# EAGLE design placa1 (EAGLE 8.2.2)
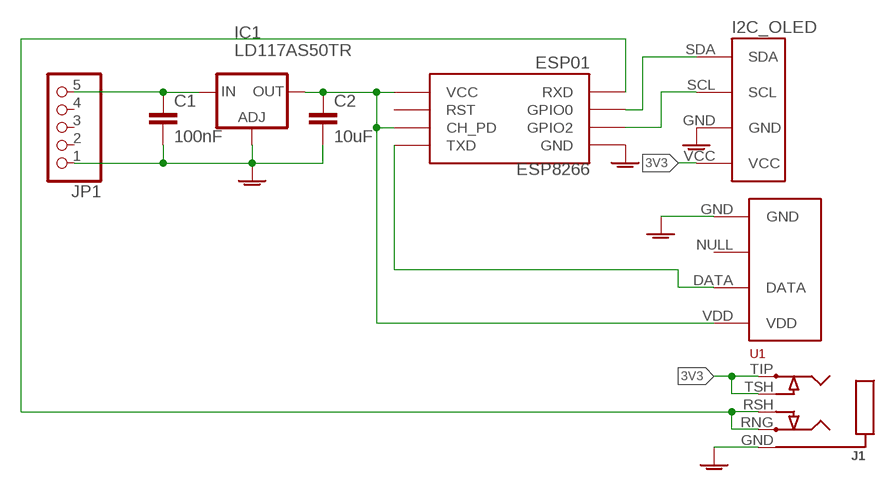
[diagram p0: schematic, sheet 1]

## Parts
C1  100nF  C-EUC1206K  [C1206K]
C2  10uF  C-EUC1206K  [C1206K]
ESP8266  ESP01  [ESP01]
IC1  LD117AS50TR  [SOT223]
J1  STEREOJACKSJ1-352XNG  [SJ1-352XNG]
JP1  PINHD-1X5  [1X05]
OLED  I2C_OLED  [I2C_OLED_PACKAGE]
U1  RHT03_DHT-22_AM2302RA  [RHT03_DHT-22/RA]

## Nets
3V3: C2.1 ESP8266.CH_PD ESP8266.VCC IC1.2(OUT) J1.TIP J1.TSH OLED.VCC U1.VDD
5V: C1.1 IC1.3(IN) JP1.5
DATA: ESP8266.TX(TXD) U1.DATA
GND: C1.2 C2.2 ESP8266.GND IC1.1(ADJ) J1.GND JP1.1 OLED.GND U1.GND ; supply symbol labelled GNDA
N$3: ESP8266.GPIO2 OLED.SCL
RX: ESP8266.RX(RXD) J1.RNG J1.RSH
SDA: ESP8266.GPIO0 OLED.SDA
Unconnected: ESP8266.RST JP1.2 JP1.3 JP1.4 U1.NULL

## Library data of the parts
C1 C2 = rcl:C-EU: CAPACITOR, European symbol
ESP8266 = esp8266modules:ESP01: ESP8266 Wifi module 01
IC1 = v-reg:LD117A?*: Low drop fixed and adjustable positive voltage regulators 1 A Source: http://www.st.com/stonline/products/literature/ds/7194/ld1117axx.pdf
J1 = Ai_Connectors:STEREOJACK: MIC/HEADPHONE JACK Stereo jack with two switches. Kycon STX3100, CUI SJ1-3555NG and/or 4UCon 05544
JP1 = pinhead:PINHD-1X5: PIN HEADER
OLED = DIYMall_OLED:I2C_OLED
U1 = dht22:RHT03_DHT-22_AM2302: RHT03 / DHT-22 / AM2302 Packages and symbol for the RHT03 / DHT-22 relative humidity and temperature sensor. Note: The AM2302 is a wired version of the DHT-22 which typically requires less clearance and is thus provided as a separate package.; PROD_ID: SEN-10167

## Board
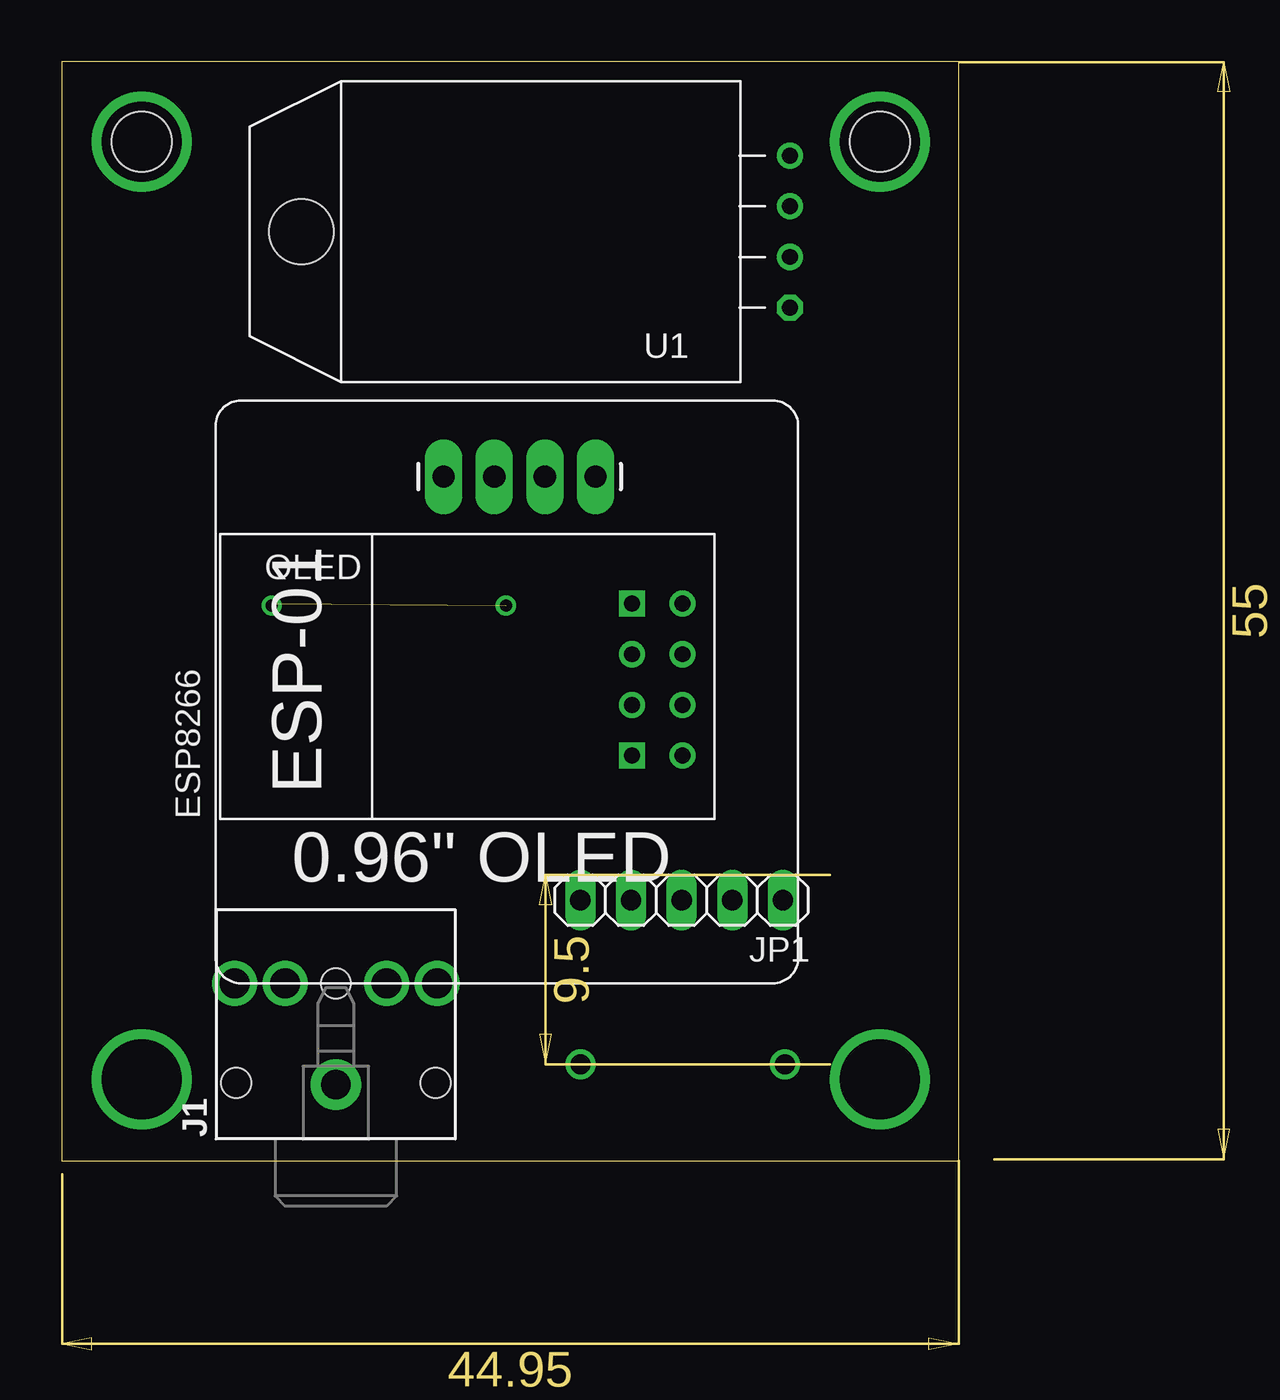
[diagram p1: board, top side]
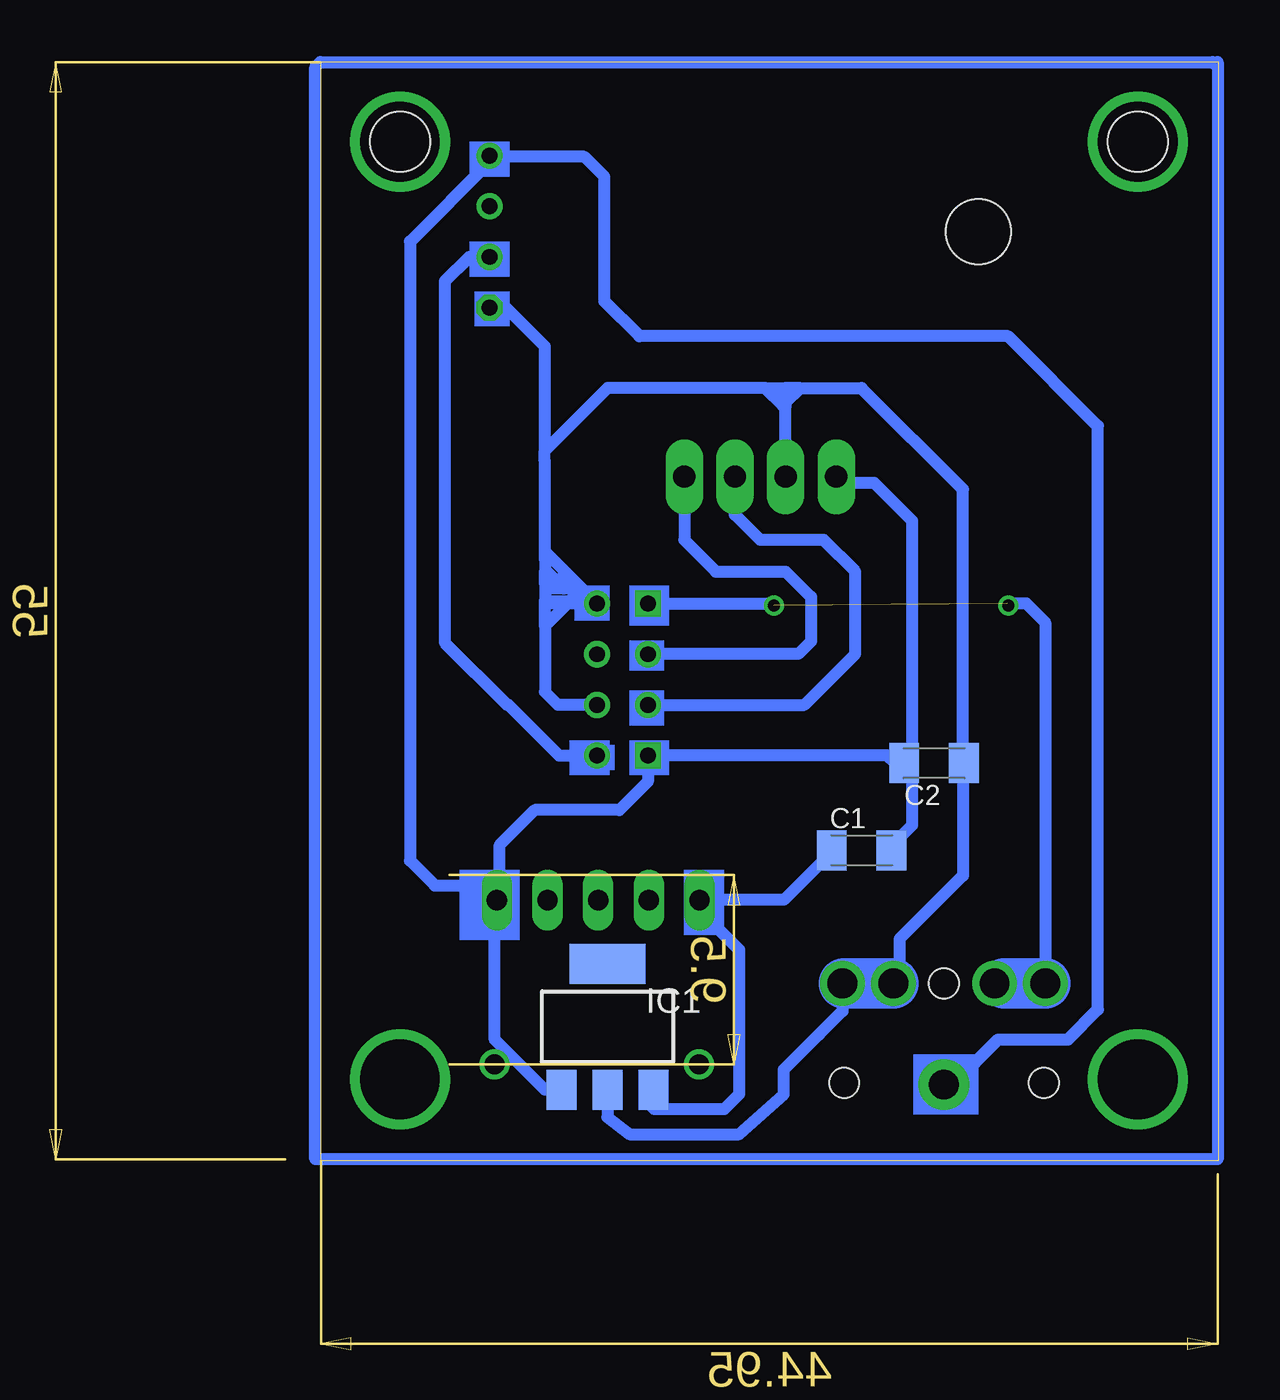
[diagram p2: board, bottom side, seen from below]

Size 44.98 x 55.12 mm. Coordinates in mm from the lower left corner, seen from the top.
Outline: 0,0 44.98,0 44.98,55.12 0,55.12 0,0
Copper layers (1*16): Top 0.035mm / dielectric 1.5mm / Bottom 0.035mm
Design rules "default": minimum track width 10mil, minimum drill 24mil, track to track 8mil, track to pad 8mil, pad to pad 8mil, via to via 8mil, smd to smd 8mil, copper to edge 40mil, drill to drill 8mil, minimum pad ring 10mil, minimum via ring 8mil, stop-mask expansion 4mil, vias tented up to drill 0mil, thermal gap 10mil
Holes 3 mm at 41.03,51.09 4.03,51.09

### Footprints (pad centres in the part's own frame; a part is rotated, then mirrored left to right if it is on the bottom)
C1206K = smd 1.5 x 2: 1 -1.5,0; 2 1.5,0
ESP01 = drill 0.8: CH_PD -1.285,-8.178; GPIO0 1.255,-5.638; GPIO2 -1.285,-5.638; RST 1.255,-8.178; TX -3.825,-8.178; VCC 3.795,-8.178 | drill 0.8 square: GND -3.825,-5.638; RX 3.795,-5.638
SOT223 = smd 1.5 x 2: 1 -2.3,-3.15; 2 0,-3.15; 3 2.3,-3.15 | smd 3.8 x 2: 4 0,3.15
SJ1-352XNG = drill 1.5 pad 2.54: GND -5.08,0 | drill 1.5: RNG 0,5.08; RSH 0,2.54; TIP 0,-5.08; TSH 0,-2.54 | hole 1.5: -5,5; -5,-5; 0,0
1X05 = drill 1.016 long: 1 -5.08,0; 2 -2.54,0; 3 0,0; 4 2.54,0; 5 5.08,0
I2C_OLED_PACKAGE = drill 1.118 pad 1.88 long: GND 0,0; SCL 5.08,0; SDA 7.62,0; VCC 2.54,0
RHT03_DHT-22/RA = drill 0.8: DATA -1.27,0; GND 3.81,0; NULL 1.27,0 | drill 0.8 octagon: VDD -3.81,0 | hole 3.25: 0,24.5

### Placement (x,y rotation side)
C1  17.88,15.58 0 bottom
C2  14.25,19.95 180 bottom
ESP8266  22.96,24.15 90 top
IC1  30.62,6.73 0 bottom
J1  13.75,8.91 90 top
JP1  31.09,13.08 180 top
OLED  19.15,34.31 0 top
U1  36.53,46.59 90 top

### Tracks (layer width: path | path; a pad name or v marks a point on that pad's centre or on a via)
3V3
  Bottom 0.61: OLED.VCC 21.69,37.84 | 21.69,38.05 21.69,38.75 | 32.81,29.61 33.76,30.56 33.76,30.17 | 32.81,29.61 31.89,28.7 | 31.89,28.7 ESP8266.VCC | 33.76,28.97 33.76,29.55 | 33.76,30.17 33.76,29.55 | 33.76,28.97 33.76,28.09 | 33.76,26.82 33.76,28.09 | 33.76,26.82 33.76,23.52 33.12,22.88 31.15,22.88 ESP8266.CH_PD | 20.98,38.75 21.69,38.75 | 20.98,38.75 17.88,38.75 12.8,33.67 12.8,19.2 | ESP8266.VCC 33.62,27.95 33.76,28.09 | 33.76,28.09 32.51,28.09 31.89,28.7 | 31.89,28.7 32.81,28.7 | 32.81,28.7 33.49,28.7 33.76,28.97 | 33.76,29.55 33.66,29.55 32.81,28.7 | 32.81,28.7 32.81,29.61 | ESP8266.VCC 32.64,27.95 33.76,26.82 | 16.58,8.91 J1.TSH 18.11,8.91 18.43,8.58 | 12.8,19.2 12.8,14.31 15.98,11.13 15.98,9.51 16.58,8.91 | 18.84,8.18 18.84,7.52 20.01,6.34 20.03,6.34 21.78,4.59 21.78,3.34 24.03,1.34 29.53,1.34 30.62,2.19 IC1.2 | 18.84,8.18 J1.TIP 18.76,8.91 | 18.76,8.91 16.58,8.91 | 18.43,8.58 18.84,8.18 | 18.76,8.91 18.43,8.58 | C2.1 12.75,19.25 12.8,19.2 | 22.72,38.75 21.69,38.75 | 22.72,38.75 30.62,38.75 33.78,35.59 | 33.78,35.59 33.78,35.09 33.78,30.19 33.76,30.17 | 21.69,37.84 21.81,37.84 22.72,38.75 | 21.69,37.84 21.69,38.05 | 21.69,38.05 20.98,38.75 | U1.VDD 35.72,42.78 33.78,40.84 33.78,35.59
  Bottom 2.54: J1.TSH 18.76,8.91
5V
  Bottom 0.61: 28.06,3.09 IC1.3 28.78,3.12 28.78,3.09 28.28,2.59 24.78,2.59 24.03,3.34 24.03,10.59 26.01,12.58 JP1.5 25.99,13.09 21.78,13.09 19.38,15.49 C1.1
DATA
  Bottom 0.61: ESP8266.TX 33.04,20.32 35.6,22.88 35.66,22.88 38.78,25.99 38.78,44.09 37.55,45.32 U1.DATA
GND
  Bottom 0.61: 15.34,19.07 16.23,19.95 | 15.34,19.07 15.34,32.09 17.25,33.99 18.84,33.99 OLED.GND | C1.2 16.38,15.81 15.34,16.85 15.34,19.07 | C2.2 16.23,19.95 | 16.23,19.95 16.61,20.34 28.59,20.34 ESP8266.GND 28.6,19.02 30.03,17.59 34.28,17.59 36.03,15.84 36.03,13.44 | 14.04,3.83 J1.GND 13.29,3.83 11.03,6.09 7.53,6.09 6.03,7.59 6.03,36.84 10.53,41.34 29.03,41.34 30.78,43.09 30.78,49.34 31.78,50.34 36.47,50.34 U1.GND 36.53,50.09 40.53,46.09 40.53,15.06 39.28,13.81 36.4,13.81 36.03,13.44 | 36.03,13.44 36.03,13.22 JP1.1 36.28,12.97 36.28,6.09 33.76,3.58 IC1.1
N$3
  Bottom 0.61: 28.59,22.88 ESP8266.GPIO2 20.75,22.86 18.2,25.42 18.2,29.55 19.79,31.13 22.96,31.13 24.23,32.41 OLED.SCL
N$4  (via drill 1)
  other vias: 36.28,4.84
N$5  (via drill 1)
  other vias: 26.03,4.84
N$8
  Bottom 0.61: 0.03,55.09 0.03,54.84 | 0.03,54.84 0.03,0.09 45.28,0.09 45.28,54.84 45.03,55.09 0.28,55.09 0.03,54.84
N$9  (via drill 4)
  other vias: 4.03,51.09
N$10  (via drill 4)
  other vias: 41.03,51.09
N$11  (via drill 4)
  other vias: 41.03,4.09
N$12  (via drill 4)
  other vias: 4.03,4.09
N$13  (via drill 0.6)
  other vias: 10.53,27.84
RX  (via drill 0.6)  (1 unrouted)
  Bottom 0.61: J1.RNG 8.68,27.01 9.63,27.96 10.58,27.96 | 10.72,8.91 J1.RSH | ESP8266.RX 22.38,27.95 v22.28,27.84
  Bottom 2.54: J1.RNG 10.72,8.91
SDA
  Bottom 0.61: OLED.SDA 26.77,31.13 25.18,29.55 21.69,29.55 20.42,28.28 20.42,26.05 21.06,25.42 28.59,25.42 ESP8266.GPIO0
(copper drawn outside any net)
  shapes: Bottom area x18